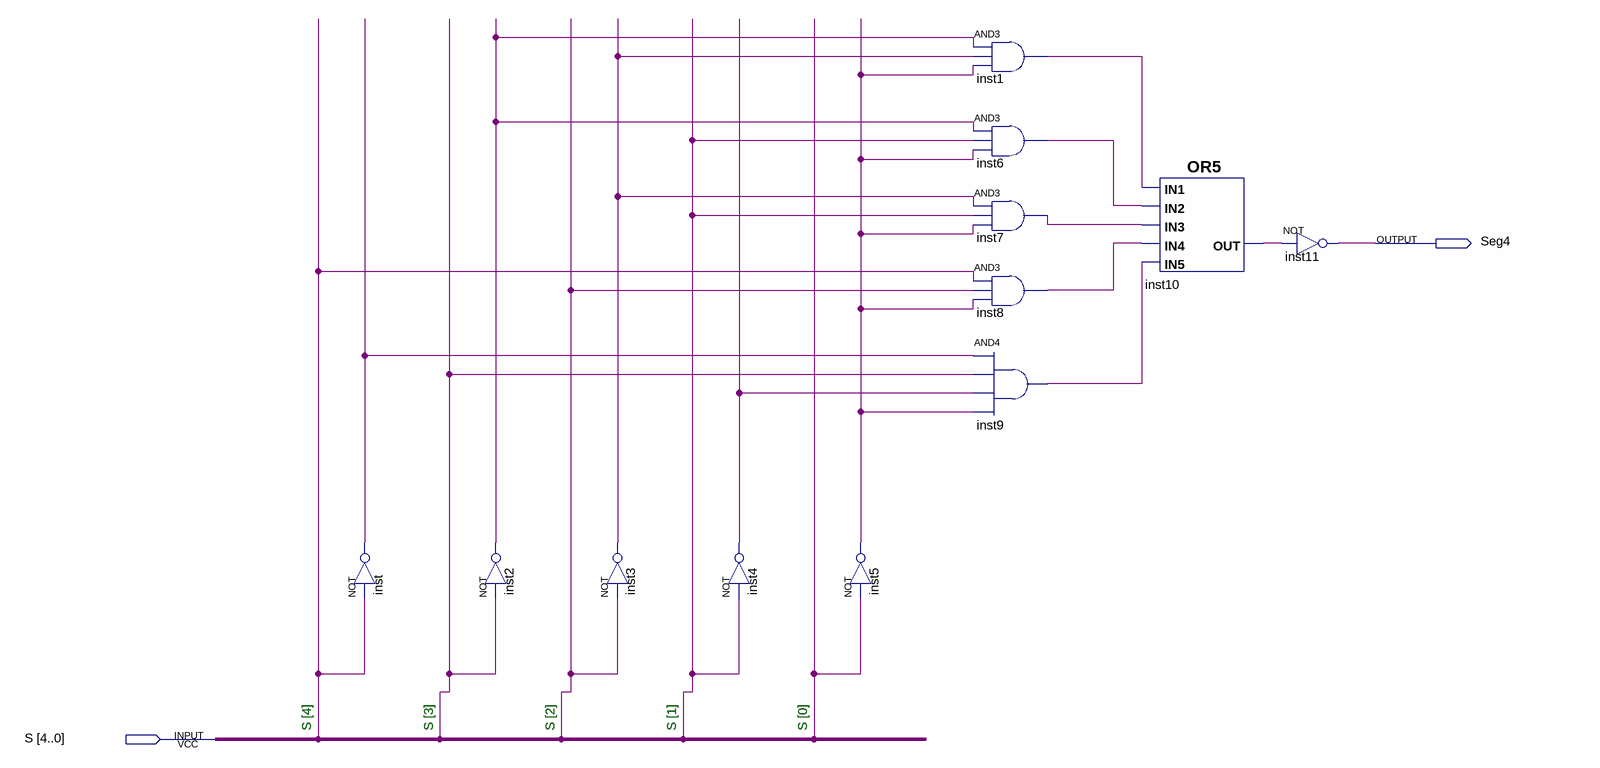
[diagram p0: schematic sheet]
// Quartus schematic Seg4.bdf as structural Verilog: 12 symbols, 2 pins
module Seg4 (
  input  [4:0] S,
  output Seg4
);

  wire inst1_out, inst2_out, inst3_out, inst4_out, inst5_out, inst6_out, inst7_out, inst8_out, inst9_out,
       inst10_out, inst_out;

  not inst (inst_out, S[4]);
  not inst2 (inst2_out, S[3]);
  not inst3 (inst3_out, S[2]);
  not inst4 (inst4_out, S[1]);
  not inst5 (inst5_out, S[0]);
  and inst1 (inst1_out, inst2_out, inst3_out, inst5_out);
  and inst6 (inst6_out, inst2_out, S[1], inst5_out);
  and inst7 (inst7_out, inst3_out, S[1], inst5_out);
  and inst8 (inst8_out, S[4], S[2], inst5_out);
  and inst9 (inst9_out, inst_out, S[3], inst4_out, inst5_out);
  or inst10 (inst10_out, inst1_out, inst6_out, inst7_out, inst8_out, inst9_out);
  not inst11 (Seg4, inst10_out);

  // Notes on the sheet:
  //   S [4]
  //   S [3]
  //   S [2]
  //   S [1]
  //   S [0]
endmodule
